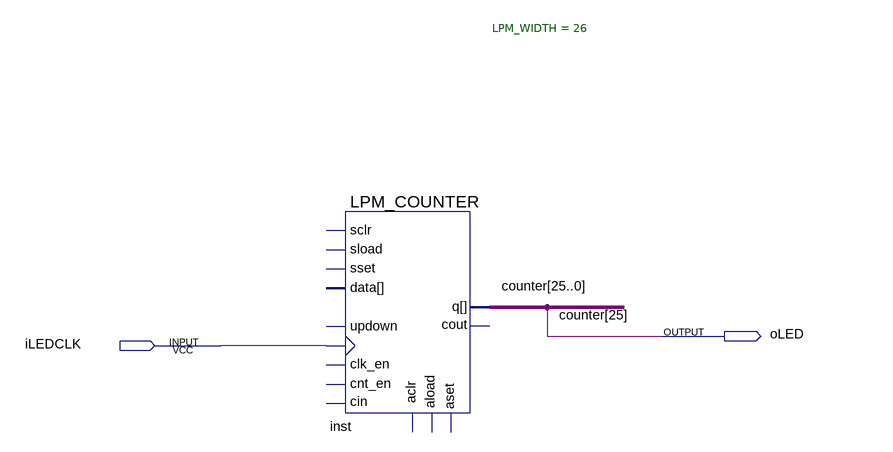
[diagram p0: schematic sheet]
// Quartus schematic TUTO_Schematic.bdf as structural Verilog: 1 symbols, 2 pins
module TUTO_Schematic (
  input  iLEDCLK,
  output oLED
);

  wire [24:0] counter;

  LPM_COUNTER #(.LPM_WIDTH(26)) inst (
    .clock(iLEDCLK), .q({oLED, counter}));  // open: sload, data, clk_en, aload, aclr, aset, cin, sset, updown, cnt_en, sclr, cout

  // Other names for the same wires on the sheet: counter[25] = oLED
endmodule
